# EAGLE design wtvAudioPlayback (EAGLE 6.2)
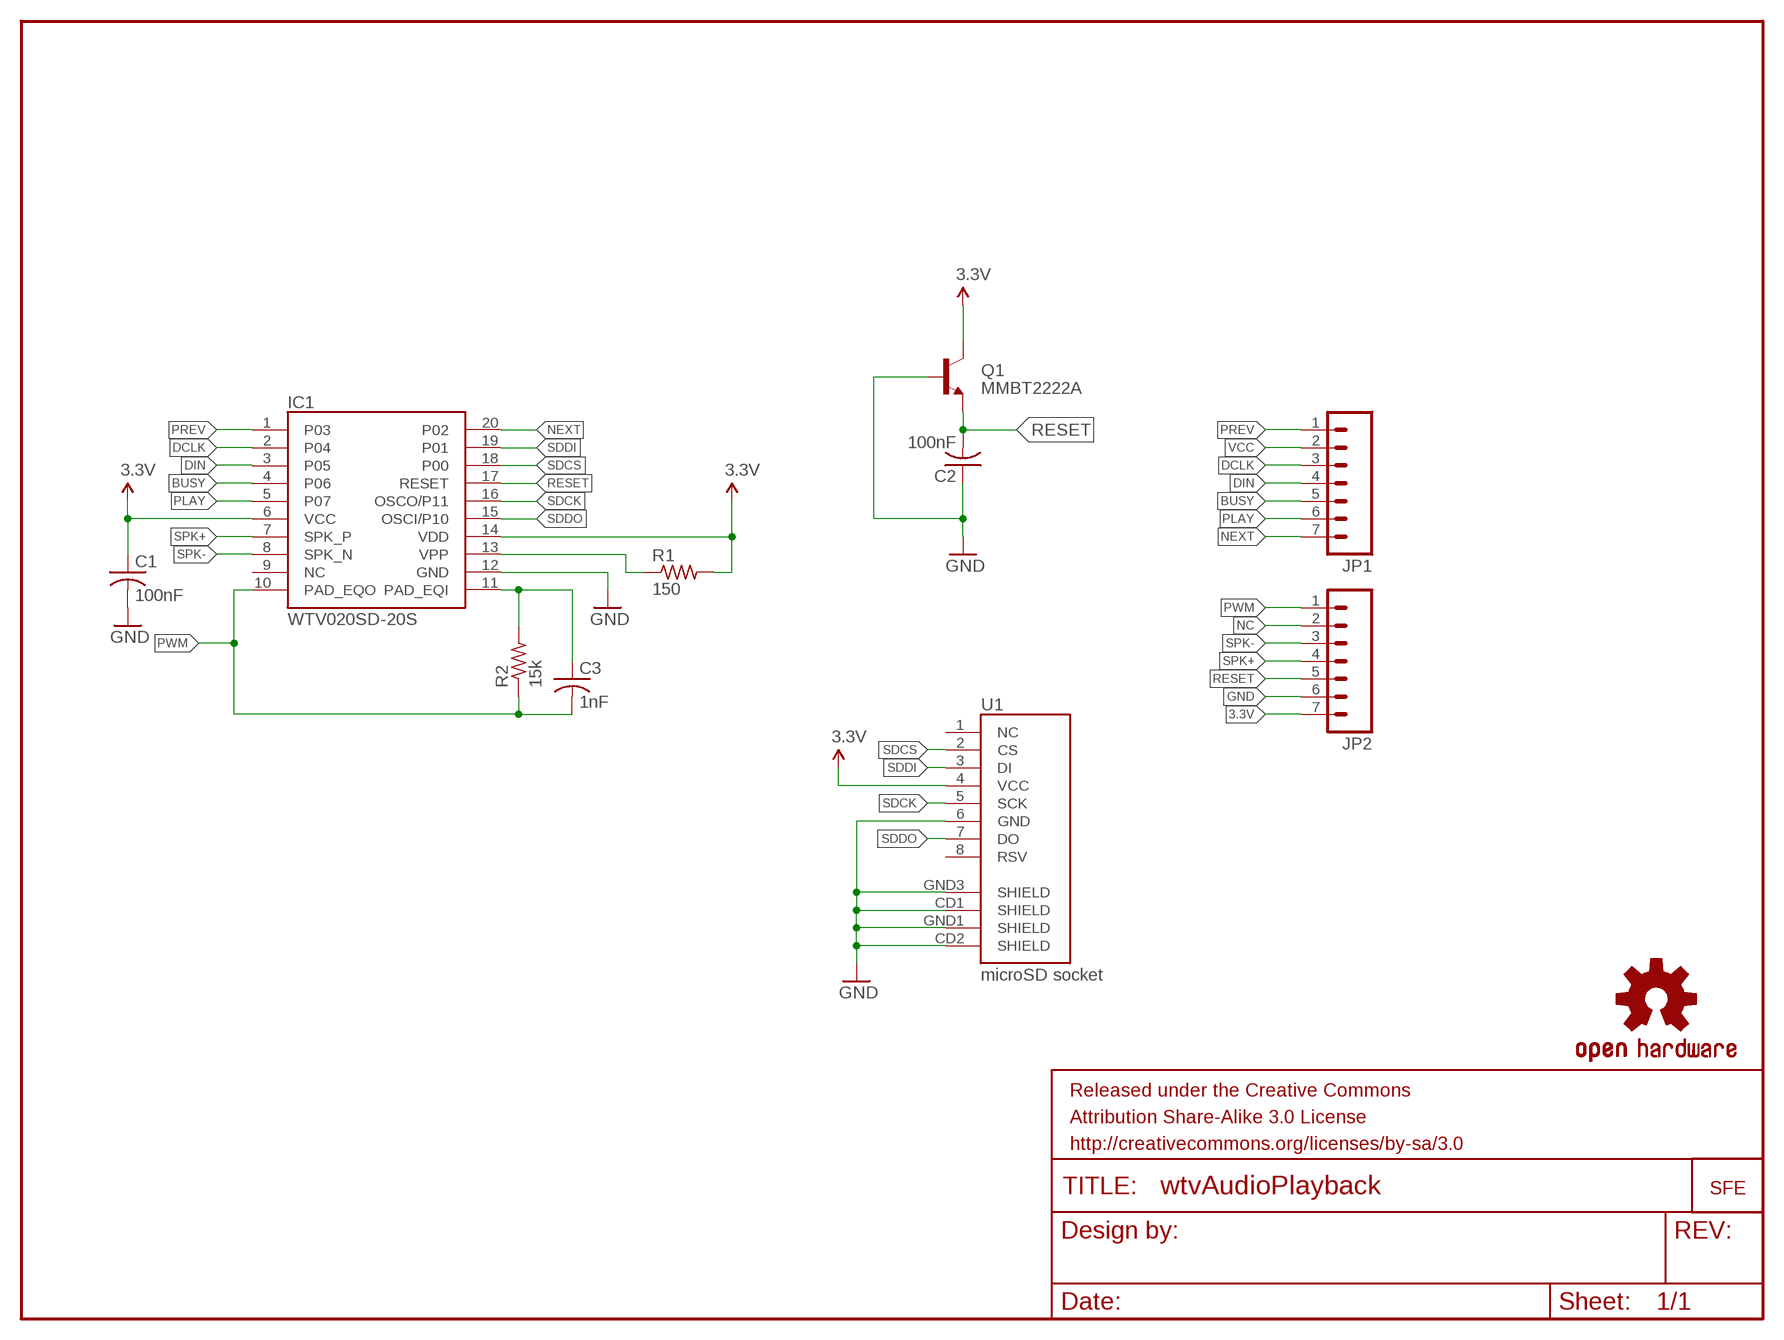
[diagram p0: schematic, sheet 1]

## Parts
C1  100nF  C-US025-024X044  [C025-024X044]
C2  100nF  C-US025-024X044  [C025-024X044]
C3  1nF  C-US025-024X044  [C025-024X044]
IC1  WTV020SD-20S  WTV020SD  [SSOP_20]
JP1  M07  [1X07]
JP2  M07  [1X07]
JP5  LOGO-SFENEW  [SFE-NEW-WEBLOGO]
Q1  MMBT2222A  TRANSISTOR_NPNSOT23  [SOT23]
R1  150  R-US_0207/2V  [0207/2V]
R2  15k  R-US_0207/2V  [0207/2V]
U1  microSD socket  USD-SOCKETNEW  [MICRO-SD-SOCKET-PP]
U$1  OSHW-LOGOS  [OSHW-LOGO-S]

## Nets
3.3V: C1.1 IC1.6(VCC) IC1.14(VDD) JP2.7 Q1.3(C) R1.2 U1.4(VCC)
BUSY: IC1.4(P06) JP1.5
DCLK: IC1.2(P04) JP1.3
DIN: IC1.3(P05) JP1.4
GND: C1.2 C2.1 IC1.12(GND) JP2.6 Q1.1(B) U1.6(GND) U1.CD1(SHIELD) U1.CD2(SHIELD) U1.GND1(SHIELD) U1.GND3(SHIELD)
N$1: IC1.13(VPP) R1.1
N$2: C3.1 IC1.11(PAD_EQI) R2.2
NC: JP2.2
NEXT: IC1.20(P02) JP1.7
PLAY: IC1.5(P07) JP1.6
PREV: IC1.1(P03) JP1.1
PWM: C3.2 IC1.10(PAD_EQO) JP2.1 R2.1
RESET: C2.2 IC1.17(RESET) JP2.5 Q1.2(E)
SDCK: IC1.16(OSCO/P11) U1.5(SCK)
SDCS: IC1.18(P00) U1.2(CS)
SDDI: IC1.19(P01) U1.3(DI)
SDDO: IC1.15(OSCI/P10) U1.7(DO)
SPK+: IC1.7(SPK_P) JP2.4
SPK-: IC1.8(SPK_N) JP2.3
VCC: JP1.2
Unconnected: IC1.9(NC) U1.1(NC) U1.8(RSV)

## Library data of the parts
C1 = adafruit:C-US: CAPACITOR, American symbol; PROD_ID: CAP-00810
C2 = adafruit:C-US: CAPACITOR, American symbol; MFG: Multiple; PROD_#: CAP-00810; SKU: NA; SPARKLE_ID: 918
C3 = adafruit:C-US: CAPACITOR, American symbol; PROD_ID: CAP-07886
IC1 = SparkFun-DigitalIC:WTV020SD: SD audio playback IC Can play back .wav or .ad4 files from an SD card SPI control or digital input trigger control available in SSOP-20 or DIP-20; PROD_#: NA; PROD_ID: IC-11012; SKU: NA; SPARKLE_ID: 6000
JP1 JP2 = SparkFun-Connectors:M07: Header 7 Standard 7-pin 0.1" header. Use with straight break away headers (SKU : PRT-00116), right angle break away headers (PRT-00553), swiss pins (PRT-00743), machine pins (PRT-00117), and female headers (PRT-00115). NOTES ON THE VARIANTS LOCK and LOCK_LONGPADS... This footprint was designed to help hold the alignment of a through-hole component (i.e. 7-pin header) while soldering it into place. You may notice that each hole has been shifted either up or down by 0.005 of an inch from it's more standard position (which is usually a perfectly straight line). This slight alteration caused the pins (the squares in the middle) to touch the edges of the holes. Because they are alternating, it causes a "brace" to hold the header in place. 0.005 has proven to be the perfect amount of "off-center" position when using our standard breakaway headers. Although looks a little odd when you look at the bare footprint, once you have a header in there, the alteration is very hard to notice. Also, if you push a header all the way into place, it is covered up entirely on the bottom side. This idea of altering the position of holes to aid alignment will be further integrated into the Sparkfun Library for other footprints. It can help hold any component with 3 or more connection pins.
JP5 = SparkFun-Aesthetics:LOGO-SFE: Spark Fun Electronics PCB Logo This is the standard Spark Fun Electronics PCB logo.
Q1 = SparkFun-DiscreteSemi:TRANSISTOR_NPN: Generic NPN BJT. MMBT2222 is the common NPN we use. Double check against datasheet- not all devices are the same!; PROD_ID: TRANS-08049
R1 = adafruit:R-US_: RESISTOR, American symbol; PROD_ID: RES-11028
R2 = adafruit:R-US_: RESISTOR, American symbol; PROD_ID: RES-07854
U1 = SparkFun-Connectors:USD-SOCKET: microSD Socket Push-push type uSD socket. Schematic element and footprint production proven. Spark Fun Electronics SKU : PRT-00127. tDoc lines correctly indicate media card edge positions when inserting (unlocked, locked, depressed).; PROD_ID: CONN-07820
U$1 = SparkFun-Aesthetics:OSHW-LOGO: Open Source Hardware Logo This logo indicates the piece of hardware it is found on incorporates a OSHW license and/or adheres to the definition of open source hardware found here: http://freedomdefined.org/OSHW

## Board
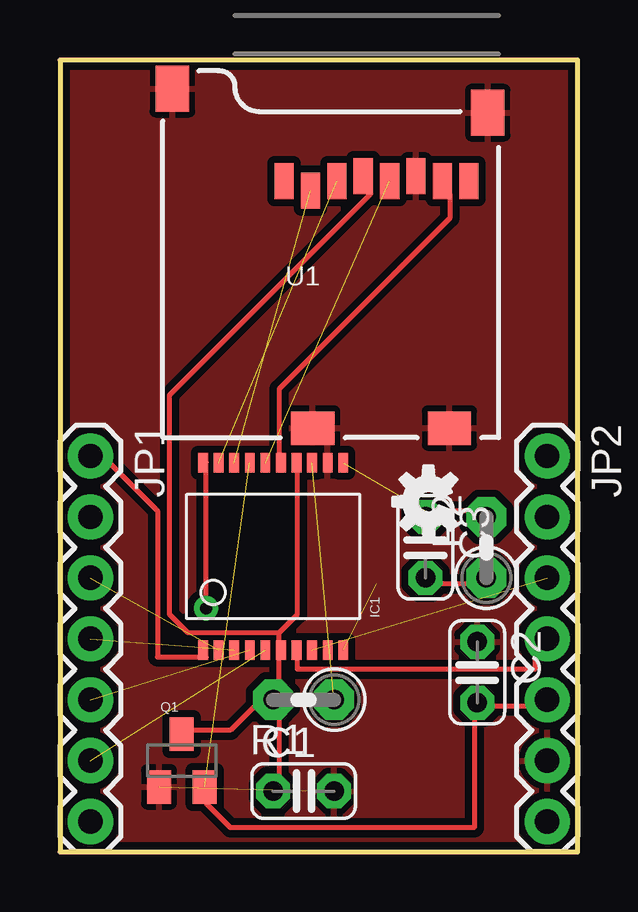
[diagram p1: board, top side]
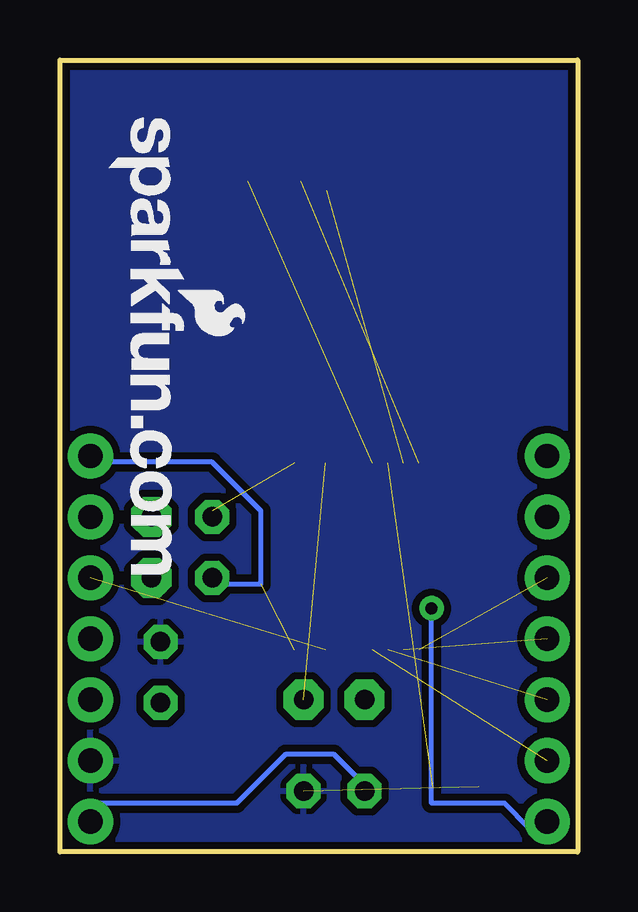
[diagram p2: board, bottom side, seen from below]

Size 21.59 x 33.02 mm. Coordinates in mm from the lower left corner, seen from the top.
Outline: 0,0 21.59,0 21.59,33.02 0,33.02 0,0
Copper layers (1*16): Top 0.035mm / dielectric 1.5mm / Bottom 0.035mm
Design rules: minimum track width 8mil, minimum drill 20mil, track to track 8mil, track to pad 8mil, pad to pad 8mil, via to via 8mil, smd to smd 8mil, copper to edge 8mil, drill to drill 8mil, minimum pad ring 12mil, minimum via ring 10mil, stop-mask expansion 4mil, vias tented up to drill 20mil, thermal gap 10mil

### Footprints (pad centres in the part's own frame; a part is rotated, then mirrored left to right if it is on the bottom)
C025-024X044 = drill 0.813 pad 1.422 octagon: 1 -1.27,0; 2 1.27,0
SSOP_20 = smd 0.813 x 0.406: 1 -3.9,2.925; 2 -3.9,2.275; 3 -3.9,1.625; 4 -3.9,0.975; 5 -3.9,0.325; 6 -3.9,-0.325; 7 -3.9,-0.975; 8 -3.9,-1.625; 9 -3.9,-2.275; 10 -3.9,-2.925; 11 3.9,-2.925; 12 3.9,-2.275; 13 3.9,-1.625; 14 3.9,-0.975; 15 3.9,-0.325; 16 3.9,0.325; 17 3.9,0.975; 18 3.9,1.625; 19 3.9,2.275; 20 3.9,2.925
1X07 = drill 1.016 pad 1.88: 1 0,0; 2 2.54,0; 3 5.08,0; 4 7.62,0; 5 10.16,0; 6 12.7,0; 7 15.24,0
SOT23 = smd 1 x 1.4: 1 -0.95,-1.1; 2 0.95,-1.1; 3 0,1.1
0207/2V = drill 0.813 pad 1.676 octagon: 1 -1.27,0; 2 1.27,0
MICRO-SD-SOCKET-PP = smd 0.8 x 1.5: 1 -8.94,10.7; 2 -7.84,10.3; 3 -6.74,10.7; 4 -5.64,10.9; 5 -4.54,10.7; 6 -3.44,10.9; 7 -2.34,10.7; 8 -1.24,10.7 | smd 1.8 x 1.4: CD1 -2.05,0.4; CD2 -7.75,0.4 | smd 1.4 x 1.9: GND1 -13.6,14.55; GND3 -0.45,13.55

### Placement (x,y rotation side)
C1  10.16,2.54 0 top
C2  17.4,7.49 270 top
C3  15.24,12.7 270 top
IC1  8.89,12.32 90 top
JP1  1.27,16.51 270 top
JP2  20.32,16.51 270 top
JP5  19.56,30.61 270 bottom
Q1  5.08,3.81 0 top
R1  10.16,6.35 180 top
R2  17.78,12.7 90 top
U1  18.29,17.27 0 top
U$1  15.37,14.61 90 top

### Tracks (layer width: path | path; a pad name or v marks a point on that pad's centre or on a via)
3.3V
  Top 0.203: R1.2 9.14,7.11 9.14,8.13 IC1.6 9.14,8.38 9.14,9.14 | Q1.3 5.08,5.08 7.11,5.08 8.13,6.1 R1.2 | C1.1 9.14,3.05 9.14,6.1 R1.2 | 9.14,9.14 9.91,9.91 9.91,16 IC1.14 | 9.14,9.14 5.33,9.14 4.57,9.91 4.57,19.05 12.95,27.43 U1.4
  Bottom 0.203: JP2.7 20.32,2.03 14.22,2.03 12.19,4.06 10.16,4.06 9.14,3.05 C1.1
BUSY  (1 unrouted)
DCLK  (1 unrouted)
DIN  (1 unrouted)
GND  (1 unrouted)
  pour Bottom (isolate 0.305): 0,33.02 21.59,33.02 21.59,0 0,0
  pour Top (isolate 0.305): 0,33.02 21.59,33.02 21.59,0 0,0
N$1  (1 unrouted)
N$2  (1 unrouted)
  Top 0.203: C3.1 15.24,14.22 17.27,14.22 R2.2
NEXT  (via drill 0.51)
  Top 0.203: v6.1,10.16 6.1,16.26 IC1.20
  Bottom 0.203: v6.1,10.16 6.1,2.03 3.05,2.03 2.03,1.02 JP1.7
PLAY  (1 unrouted)
PREV
  Top 0.203: IC1.1 6.1,8.13 4.06,8.13 4.06,14.22 2.03,16.26 JP1.1
PWM  (1 unrouted)
  Top 0.203: C3.2 15.24,11.18 17.27,11.18 R2.1
  Bottom 0.203: JP2.1 20.32,16.26 15.24,16.26 13.21,14.22 13.21,11.18 15.24,11.18 C3.2
RESET  (1 unrouted)
  Top 0.203: 17.27,6.1 17.27,1.02 7.11,1.02 6.1,2.03 Q1.2 | 17.27,6.1 20.32,6.1 JP2.5 | 17.27,6.1 C2.2
SDCK  (1 unrouted)
SDCS  (1 unrouted)
SDDI  (1 unrouted)
SDDO
  Top 0.203: IC1.15 9.14,16.26 9.14,19.3 16.26,26.42 16.26,27.43 U1.7
SPK+
  Top 0.203: IC1.7 9.91,8.38 9.91,7.62 19.81,7.62 19.81,8.38 JP2.4
SPK-  (1 unrouted)

### Text on the board
_bsilk: audio | microSD | Module | PREV | PWM_OUT | VCC | NC | DCLK | SPK- | SPK- | DIN | SPK+ | BUSY | RESET | PLAY | GND | NEXT | 3.3V
tTestmark: Audio | SPK+